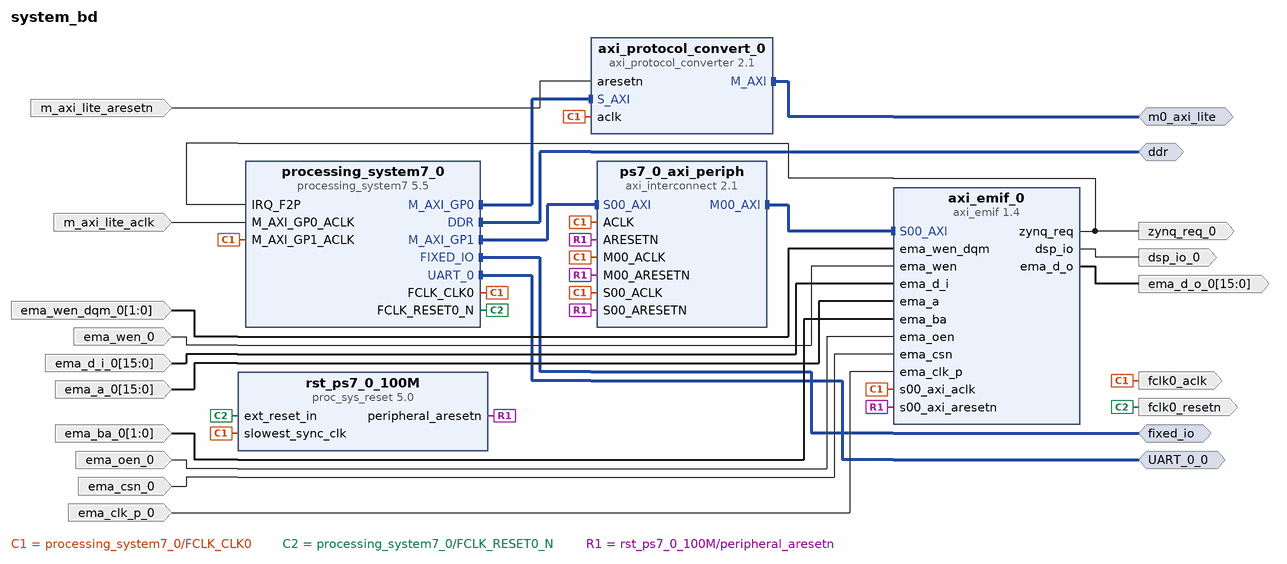
[diagram p0: block diagram of the top level]
# Vivado block design system_bd, xc7z020clg400-2, Vivado 2019.1.3
create_bd_design system_bd

create_bd_intf_port -mode Master -vlnv xilinx.com:interface:ddrx_rtl:1.0 ddr
create_bd_intf_port -mode Master -vlnv xilinx.com:display_processing_system7:fixedio_rtl:1.0 fixed_io
create_bd_intf_port -mode Master -vlnv xilinx.com:interface:aximm_rtl:1.0 m0_axi_lite
set_property -dict [list \
  CONFIG.ADDR_WIDTH 32 \
  CONFIG.CLK_DOMAIN system_bd_processing_system7_0_0_FCLK_CLK0 \
  CONFIG.DATA_WIDTH 32 \
  CONFIG.HAS_BURST 0 \
  CONFIG.HAS_CACHE 0 \
  CONFIG.HAS_LOCK 0 \
  CONFIG.HAS_QOS 0 \
  CONFIG.HAS_REGION 0 \
  CONFIG.PROTOCOL AXI4LITE \
] [get_bd_intf_ports m0_axi_lite]
create_bd_intf_port -mode Master -vlnv xilinx.com:interface:uart_rtl:1.0 UART_0_0
create_bd_port -dir I -type clk m_axi_lite_aclk
set_property -dict [list \
  CONFIG.ASSOCIATED_BUSIF m0_axi_lite \
  CONFIG.ASSOCIATED_RESET m_axi_lite_aresetn \
  CONFIG.CLK_DOMAIN system_bd_processing_system7_0_0_FCLK_CLK0 \
  CONFIG.FREQ_HZ 100000000 \
] [get_bd_ports m_axi_lite_aclk]
create_bd_port -dir I -type rst m_axi_lite_aresetn
create_bd_port -dir O -type rst fclk0_resetn
create_bd_port -dir O -type clk fclk0_aclk
set_property -dict {CONFIG.ASSOCIATED_RESET fclk0_resetn} [get_bd_ports fclk0_aclk]
create_bd_port -dir O dsp_io_0
create_bd_port -dir I -from 1 -to 0 ema_wen_dqm_0
create_bd_port -dir I ema_wen_0
create_bd_port -dir I -from 15 -to 0 ema_d_i_0
create_bd_port -dir I -from 15 -to 0 ema_a_0
create_bd_port -dir O -from 15 -to 0 ema_d_o_0
create_bd_port -dir I -from 1 -to 0 ema_ba_0
create_bd_port -dir I ema_oen_0
create_bd_port -dir I ema_csn_0
create_bd_port -dir I ema_clk_p_0
create_bd_port -dir O zynq_req_0

create_bd_cell -type ip -vlnv xilinx.com:ip:processing_system7:5.5 processing_system7_0
set_property -dict [list \
  CONFIG.PCW_ENET0_PERIPHERAL_ENABLE 0 \
  CONFIG.PCW_FPGA0_PERIPHERAL_FREQMHZ 100 \
  CONFIG.PCW_GPIO_MIO_GPIO_ENABLE 1 \
  CONFIG.PCW_GPIO_MIO_GPIO_IO MIO \
  CONFIG.PCW_I2C_RESET_ENABLE 1 \
  CONFIG.PCW_IRQ_F2P_INTR 1 \
  CONFIG.PCW_PRESET_BANK1_VOLTAGE {LVCMOS 1.8V} \
  CONFIG.PCW_QSPI_GRP_SINGLE_SS_ENABLE 1 \
  CONFIG.PCW_QSPI_GRP_SINGLE_SS_IO {MIO 1 .. 6} \
  CONFIG.PCW_QSPI_PERIPHERAL_ENABLE 1 \
  CONFIG.PCW_QSPI_QSPI_IO {MIO 1 .. 6} \
  CONFIG.PCW_SINGLE_QSPI_DATA_MODE x4 \
  CONFIG.PCW_UART0_PERIPHERAL_ENABLE 1 \
  CONFIG.PCW_UART0_UART0_IO EMIO \
  CONFIG.PCW_UART1_PERIPHERAL_ENABLE 0 \
  CONFIG.PCW_UART_PERIPHERAL_FREQMHZ 100 \
  CONFIG.PCW_UIPARAM_DDR_BUS_WIDTH {16 Bit} \
  CONFIG.PCW_UIPARAM_DDR_PARTNO {MT41K256M16 RE-125} \
  CONFIG.PCW_USB_RESET_ENABLE 1 \
  CONFIG.PCW_USE_FABRIC_INTERRUPT 1 \
  CONFIG.PCW_USE_M_AXI_GP1 1 \
] [get_bd_cells processing_system7_0]
# 203 more settings of processing_system7_0 are not shown: defaults, MIO pin electricals, DDR timing, and values the tool derives
create_bd_cell -type ip -vlnv xilinx.com:ip:axi_protocol_converter:2.1 axi_protocol_convert_0
create_bd_cell -type ip -vlnv xilinx.com:ip:axi_interconnect:2.1 ps7_0_axi_periph
set_property -dict {CONFIG.NUM_MI 1} [get_bd_cells ps7_0_axi_periph]
create_bd_cell -type ip -vlnv xilinx.com:ip:proc_sys_reset:5.0 rst_ps7_0_100M
create_bd_cell -type ip -vlnv xilinx.com:user:axi_emif:1.4 axi_emif_0

# ---- connections ----

connect_bd_intf_net [get_bd_intf_pins processing_system7_0/M_AXI_GP1] [get_bd_intf_pins ps7_0_axi_periph/S00_AXI]
connect_bd_intf_net [get_bd_intf_ports fixed_io] [get_bd_intf_pins processing_system7_0/FIXED_IO]
connect_bd_intf_net [get_bd_intf_ports m0_axi_lite] [get_bd_intf_pins axi_protocol_convert_0/M_AXI]
connect_bd_intf_net [get_bd_intf_ports ddr] [get_bd_intf_pins processing_system7_0/DDR]
connect_bd_intf_net [get_bd_intf_pins processing_system7_0/M_AXI_GP0] [get_bd_intf_pins axi_protocol_convert_0/S_AXI]
connect_bd_intf_net [get_bd_intf_pins ps7_0_axi_periph/M00_AXI] [get_bd_intf_pins axi_emif_0/S00_AXI]
connect_bd_intf_net [get_bd_intf_ports UART_0_0] [get_bd_intf_pins processing_system7_0/UART_0]
connect_bd_net [get_bd_pins processing_system7_0/FCLK_CLK0] \
  [get_bd_pins axi_protocol_convert_0/aclk] [get_bd_ports fclk0_aclk] [get_bd_pins processing_system7_0/M_AXI_GP1_ACLK] \
  [get_bd_pins ps7_0_axi_periph/S00_ACLK] [get_bd_pins rst_ps7_0_100M/slowest_sync_clk] \
  [get_bd_pins ps7_0_axi_periph/M00_ACLK] [get_bd_pins ps7_0_axi_periph/ACLK] [get_bd_pins axi_emif_0/s00_axi_aclk]
connect_bd_net [get_bd_pins processing_system7_0/FCLK_RESET0_N] [get_bd_ports fclk0_resetn] [get_bd_pins rst_ps7_0_100M/ext_reset_in]
connect_bd_net [get_bd_ports m_axi_lite_aclk] [get_bd_pins processing_system7_0/M_AXI_GP0_ACLK]
connect_bd_net [get_bd_ports m_axi_lite_aresetn] [get_bd_pins axi_protocol_convert_0/aresetn]
connect_bd_net [get_bd_pins rst_ps7_0_100M/peripheral_aresetn] \
  [get_bd_pins ps7_0_axi_periph/S00_ARESETN] [get_bd_pins ps7_0_axi_periph/M00_ARESETN] \
  [get_bd_pins ps7_0_axi_periph/ARESETN] [get_bd_pins axi_emif_0/s00_axi_aresetn]
connect_bd_net [get_bd_pins axi_emif_0/dsp_io] [get_bd_ports dsp_io_0]
connect_bd_net -net ema_wen_dqm_0_1 [get_bd_ports ema_wen_dqm_0] [get_bd_pins axi_emif_0/ema_wen_dqm]
connect_bd_net -net ema_wen_0_1 [get_bd_ports ema_wen_0] [get_bd_pins axi_emif_0/ema_wen]
connect_bd_net -net ema_d_i_0_1 [get_bd_ports ema_d_i_0] [get_bd_pins axi_emif_0/ema_d_i]
connect_bd_net -net ema_a_0_1 [get_bd_ports ema_a_0] [get_bd_pins axi_emif_0/ema_a]
connect_bd_net [get_bd_pins axi_emif_0/ema_d_o] [get_bd_ports ema_d_o_0]
connect_bd_net -net ema_ba_0_1 [get_bd_ports ema_ba_0] [get_bd_pins axi_emif_0/ema_ba]
connect_bd_net -net ema_oen_0_1 [get_bd_ports ema_oen_0] [get_bd_pins axi_emif_0/ema_oen]
connect_bd_net -net ema_csn_0_1 [get_bd_ports ema_csn_0] [get_bd_pins axi_emif_0/ema_csn]
connect_bd_net -net ema_clk_p_0_1 [get_bd_ports ema_clk_p_0] [get_bd_pins axi_emif_0/ema_clk_p]
connect_bd_net [get_bd_pins axi_emif_0/zynq_req] [get_bd_ports zynq_req_0] [get_bd_pins processing_system7_0/IRQ_F2P]

# ---- address map ----
assign_bd_address -offset 0x43C00000 -range 64K -target_address_space [get_bd_addr_spaces processing_system7_0/Data] [get_bd_addr_segs m0_axi_lite/Reg]
assign_bd_address -offset 0x83C00000 -range 64K -target_address_space [get_bd_addr_spaces processing_system7_0/Data] [get_bd_addr_segs axi_emif_0/S00_AXI/S00_AXI_reg]

validate_bd_design
save_bd_design
